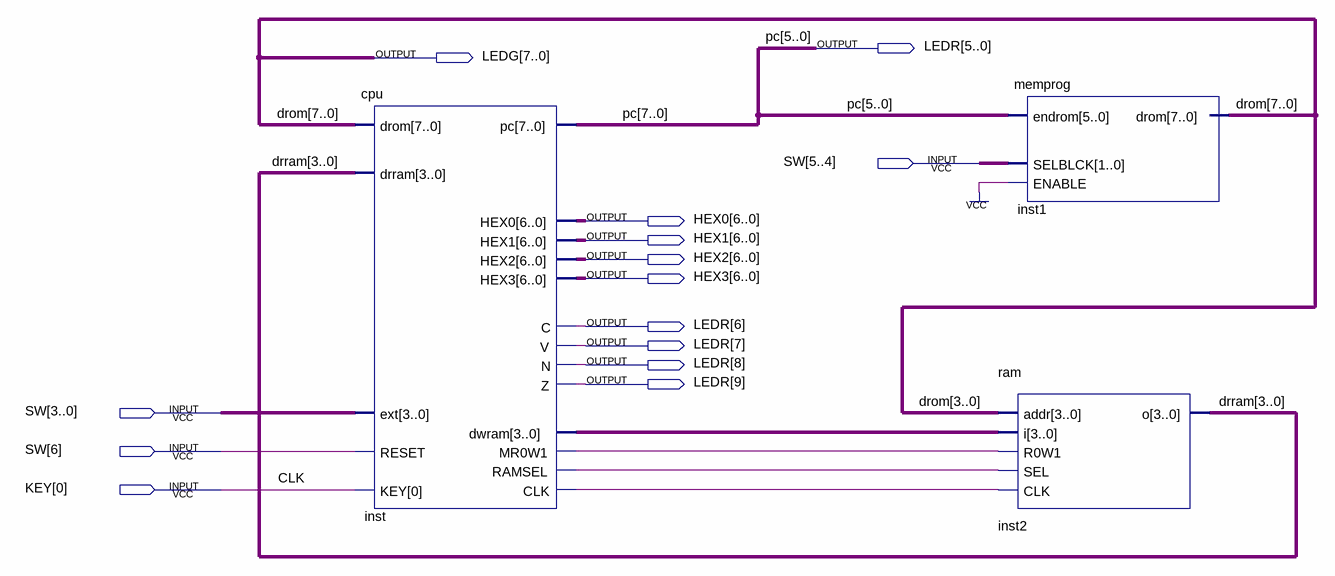
[diagram p0: schematic sheet]
// Quartus schematic computador_simplificado.bdf as structural Verilog: 3 symbols, 14 pins
module computador_simplificado (
  input  [6:0] SW,
  input  [0:0] KEY,
  output [9:0] LEDR,
  output [7:0] LEDG,
  output [6:0] HEX0,
  output [6:0] HEX1,
  output [6:0] HEX2,
  output [6:0] HEX3
);

  wire inst_clk, inst_mr0w1, inst_ramsel;
  wire [3:0] drram, inst_dwram;
  wire [7:6] pc;

  cpu inst (
    .KEY(KEY[0]), .drom(LEDG), .RESET(SW[6]), .ext(SW[3:0]), .drram(drram), .CLK(inst_clk),
    .pc({pc, LEDR[5:0]}), .dwram(inst_dwram), .RAMSEL(inst_ramsel), .C(LEDR[6]), .V(LEDR[7]),
    .MR0W1(inst_mr0w1), .N(LEDR[8]), .Z(LEDR[9]), .HEX1(HEX1), .HEX0(HEX0), .HEX3(HEX3), .HEX2(HEX2));
  memprog inst1 (.endrom(LEDR[5:0]), .ENABLE(1'b1), .SELBLCK(SW[5:4]), .drom(LEDG));
  ram inst2 (.i(inst_dwram), .SEL(inst_ramsel), .addr(LEDG[3:0]), .R0W1(inst_mr0w1), .CLK(inst_clk), .o(drram));

  // Other names for the same wires on the sheet: CLK = KEY[0]; drom[7:0] = LEDG; pc[5:0] = LEDR[5:0]
endmodule
